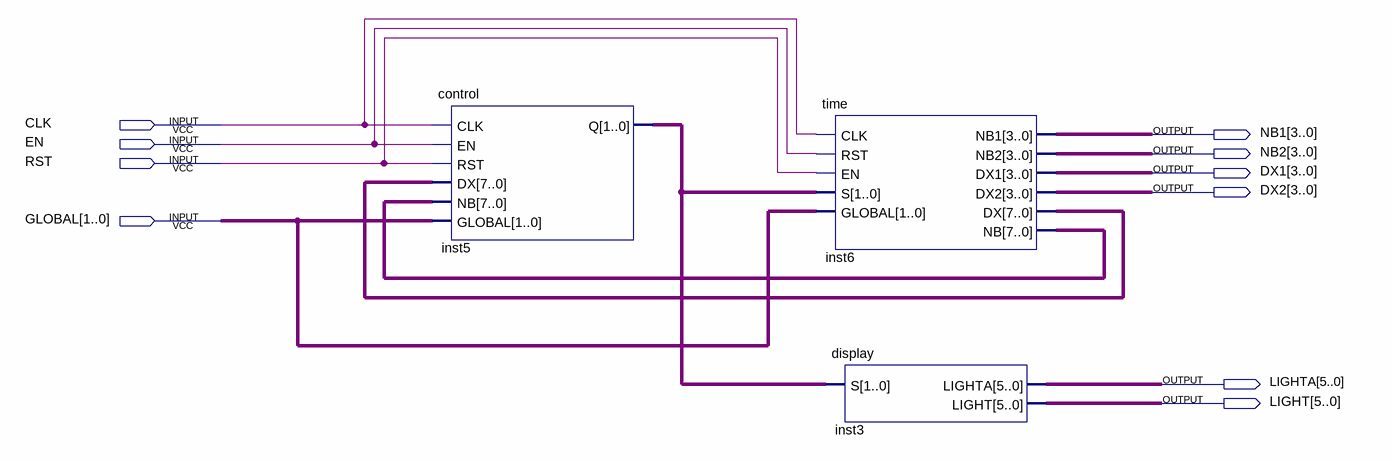
[diagram p0: schematic sheet]
// Quartus schematic traffic.bdf as structural Verilog: 3 symbols, 10 pins
module traffic (
  input  CLK,
  input  EN,
  input  RST,
  input  [1:0] GLOBAL,
  output [3:0] NB1,
  output [3:0] NB2,
  output [3:0] DX1,
  output [3:0] DX2,
  output [5:0] LIGHTA,
  output [5:0] LIGHT
);

  wire [1:0] inst5_q;
  wire [7:0] inst6_dx, inst6_nb;

  control inst5 (.CLK(CLK), .EN(EN), .RST(RST), .DX(inst6_dx), .NB(inst6_nb), .GLOBAL(GLOBAL), .Q(inst5_q));
  \time  inst6 (
    .CLK(CLK), .RST(EN), .EN(RST), .S(inst5_q), .GLOBAL(GLOBAL), .NB1(NB1), .NB2(NB2), .DX1(DX1), .DX2(DX2),
    .DX(inst6_dx), .NB(inst6_nb));
  display inst3 (.S(inst5_q), .LIGHTA(LIGHTA), .LIGHT(LIGHT));
endmodule
